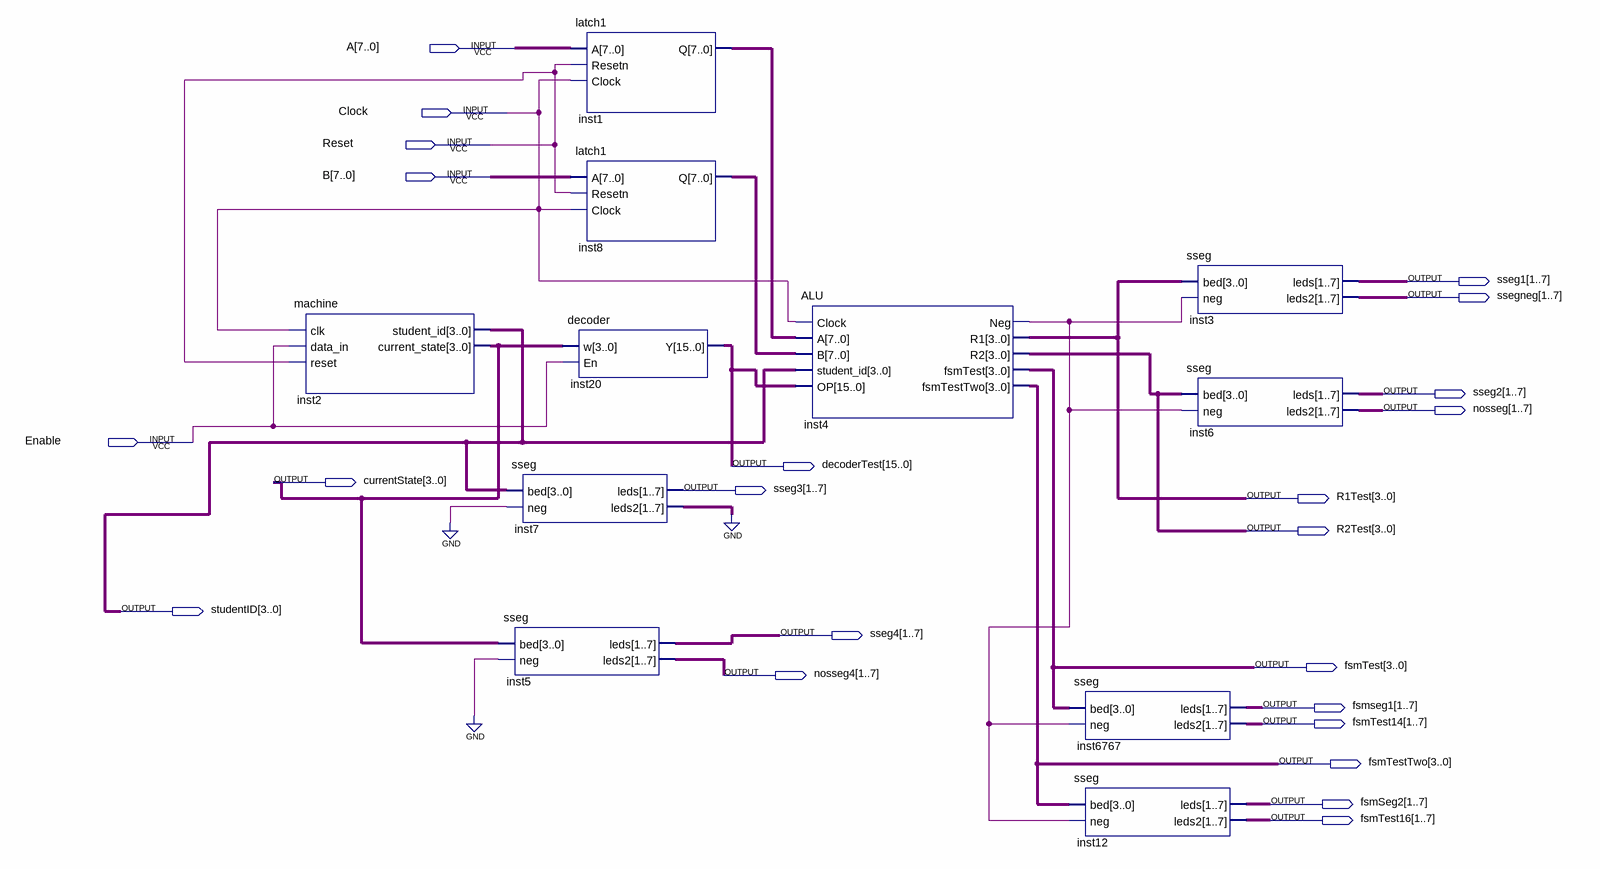
[diagram p0: schematic sheet]
// Quartus schematic lab6.bdf as structural Verilog: 11 symbols, 23 pins
module lab6 (
  input  [7:0] A,
  input  Clock,
  input  Reset,
  input  [7:0] B,
  input  Enable,
  output [1:7] sseg1,
  output [1:7] ssegneg,
  output [1:7] sseg2,
  output [1:7] nosseg,
  output [15:0] decoderTest,
  output [3:0] currentState,
  output [1:7] sseg3,
  output [3:0] R1Test,
  output [3:0] R2Test,
  output [3:0] studentID,
  output [1:7] sseg4,
  output [3:0] fsmTest,
  output [1:7] nosseg4,
  output [1:7] fsmseg1,
  output [1:7] fsmTest14,
  output [3:0] fsmTestTwo,
  output [1:7] fsmSeg2,
  output [1:7] fsmTest16
);

  wire inst4_neg;
  wire [6:0] inst7_leds2;
  wire [7:0] inst1_q, inst8_q;

  machine inst2 (.clk(Clock), .data_in(Enable), .reset(Reset), .student_id(studentID), .current_state(currentState));
  sseg inst7 (.bed(studentID), .neg(1'b0), .leds(sseg3), .leds2(inst7_leds2));
  sseg inst5 (.bed(currentState), .neg(1'b0), .leds(sseg4), .leds2(nosseg4));
  latch1 inst1 (.A(A), .Resetn(Reset), .Clock(Clock), .Q(inst1_q));
  latch1 inst8 (.A(B), .Resetn(Reset), .Clock(Clock), .Q(inst8_q));
  decoder inst20 (.w(currentState), .En(Enable), .Y(decoderTest));
  ALU inst4 (
    .Clock(Clock), .A(inst1_q), .B(inst8_q), .student_id(studentID), .OP(decoderTest), .Neg(inst4_neg),
    .R1(R1Test), .R2(R2Test), .fsmTest(fsmTest), .fsmTestTwo(fsmTestTwo));
  sseg inst6767 (.bed(fsmTest), .neg(inst4_neg), .leds(fsmseg1), .leds2(fsmTest14));
  sseg inst12 (.bed(fsmTestTwo), .neg(inst4_neg), .leds(fsmSeg2), .leds2(fsmTest16));
  sseg inst3 (.bed(R1Test), .neg(inst4_neg), .leds(sseg1), .leds2(ssegneg));
  sseg inst6 (.bed(R2Test), .neg(inst4_neg), .leds(sseg2), .leds2(nosseg));
  // also tied to GND on the sheet: {inst7_leds2[0], inst7_leds2[1], inst7_leds2[2], inst7_leds2[3], inst7_leds2[4], inst7_leds2[5], inst7_leds2[6]}
endmodule
